# Altium schematic sheet Control.SchDoc
size A4
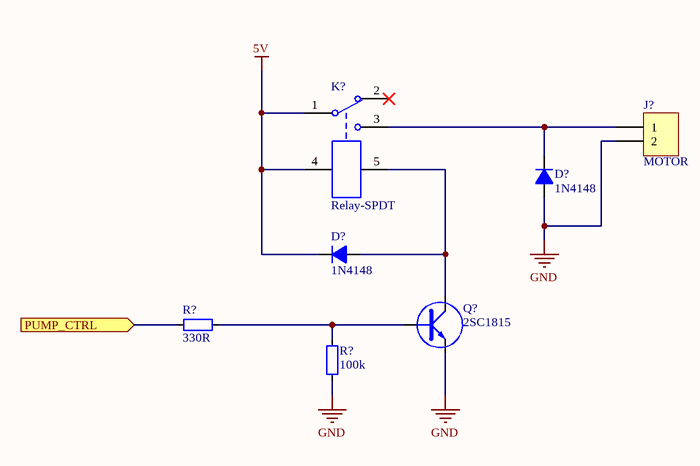
[diagram p0: Control.SchDoc]

## Parts
(Parts that share a designator on the sheet are numbered #1, #2 ... from top to bottom, then left to right.)
D?#1  1N4148  [1N4148_SMD]
D?#2  1N4148  [1N4148_SMD]
J?  MOTOR  [KF2-5.08]
K?  Relay-SPDT  [RELAY5PIN-10A]
Q?  2SC1815  [SOT23]
R?#1  330R  [RES-SMD-0805]
R?#2  100k  [RES-SMD-0805]

## Ports
PUMP_CTRL (in)

## Nets
5V: D?#2.2(K) K?.1 K?.4
GND: D?#1.1(A) J?.2 Q?.3(E) R?#2.1
PUMP_CTRL: R?#1.1 ; port PUMP_CTRL
NetD?#1_2: D?#1.2(K) J?.1 K?.3
NetD?#2_1: D?#2.1(A) K?.5 Q?.2(C)
NetQ?_1: Q?.1(B) R?#1.2 R?#2.2

Not connected (* = marked no-connect by the designer): K? 2*

## Library data of the parts
D?#1 D?#2 = D1A: Diode 1A; Value: 1N4007
J? = KF2: Manufacturer: Würth Elektronik eiSos GmbH; partNo: 691103110002; ComponentLink1 Description: Manufacturer; ComponentLink2 Description: Datasheet; NoPins: 2; Created Date: 29 October 2013; ComponentLink1URL: http://www.we-online.com; ComponentLink2URL: http://katalog.we-online.de/em/datasheet/6911031100xx.pdf; Created by: Karrer Zheng
K? = Relay-SPDT: Single-Pole Dual-Throw Relay; Published: 24-Mar-1999; LatestRevisionDate: 17-Jul-2002; LatestRevisionNote: Re-released for DXP Platform.; PackageReference: MODULE5B; Publisher: Altium Limited
Q? = 2SC1815: NPN 600mW, ECB; Value: C1815
R?#1 R?#2 = Resistor - SMD: Resistor; Manufacturer: Generic Components; Class: Passive; Published: 08/06/2000; Publisher: Altium Hobart Technology Centre